# EAGLE design pmon_log (EAGLE 6.5.0)
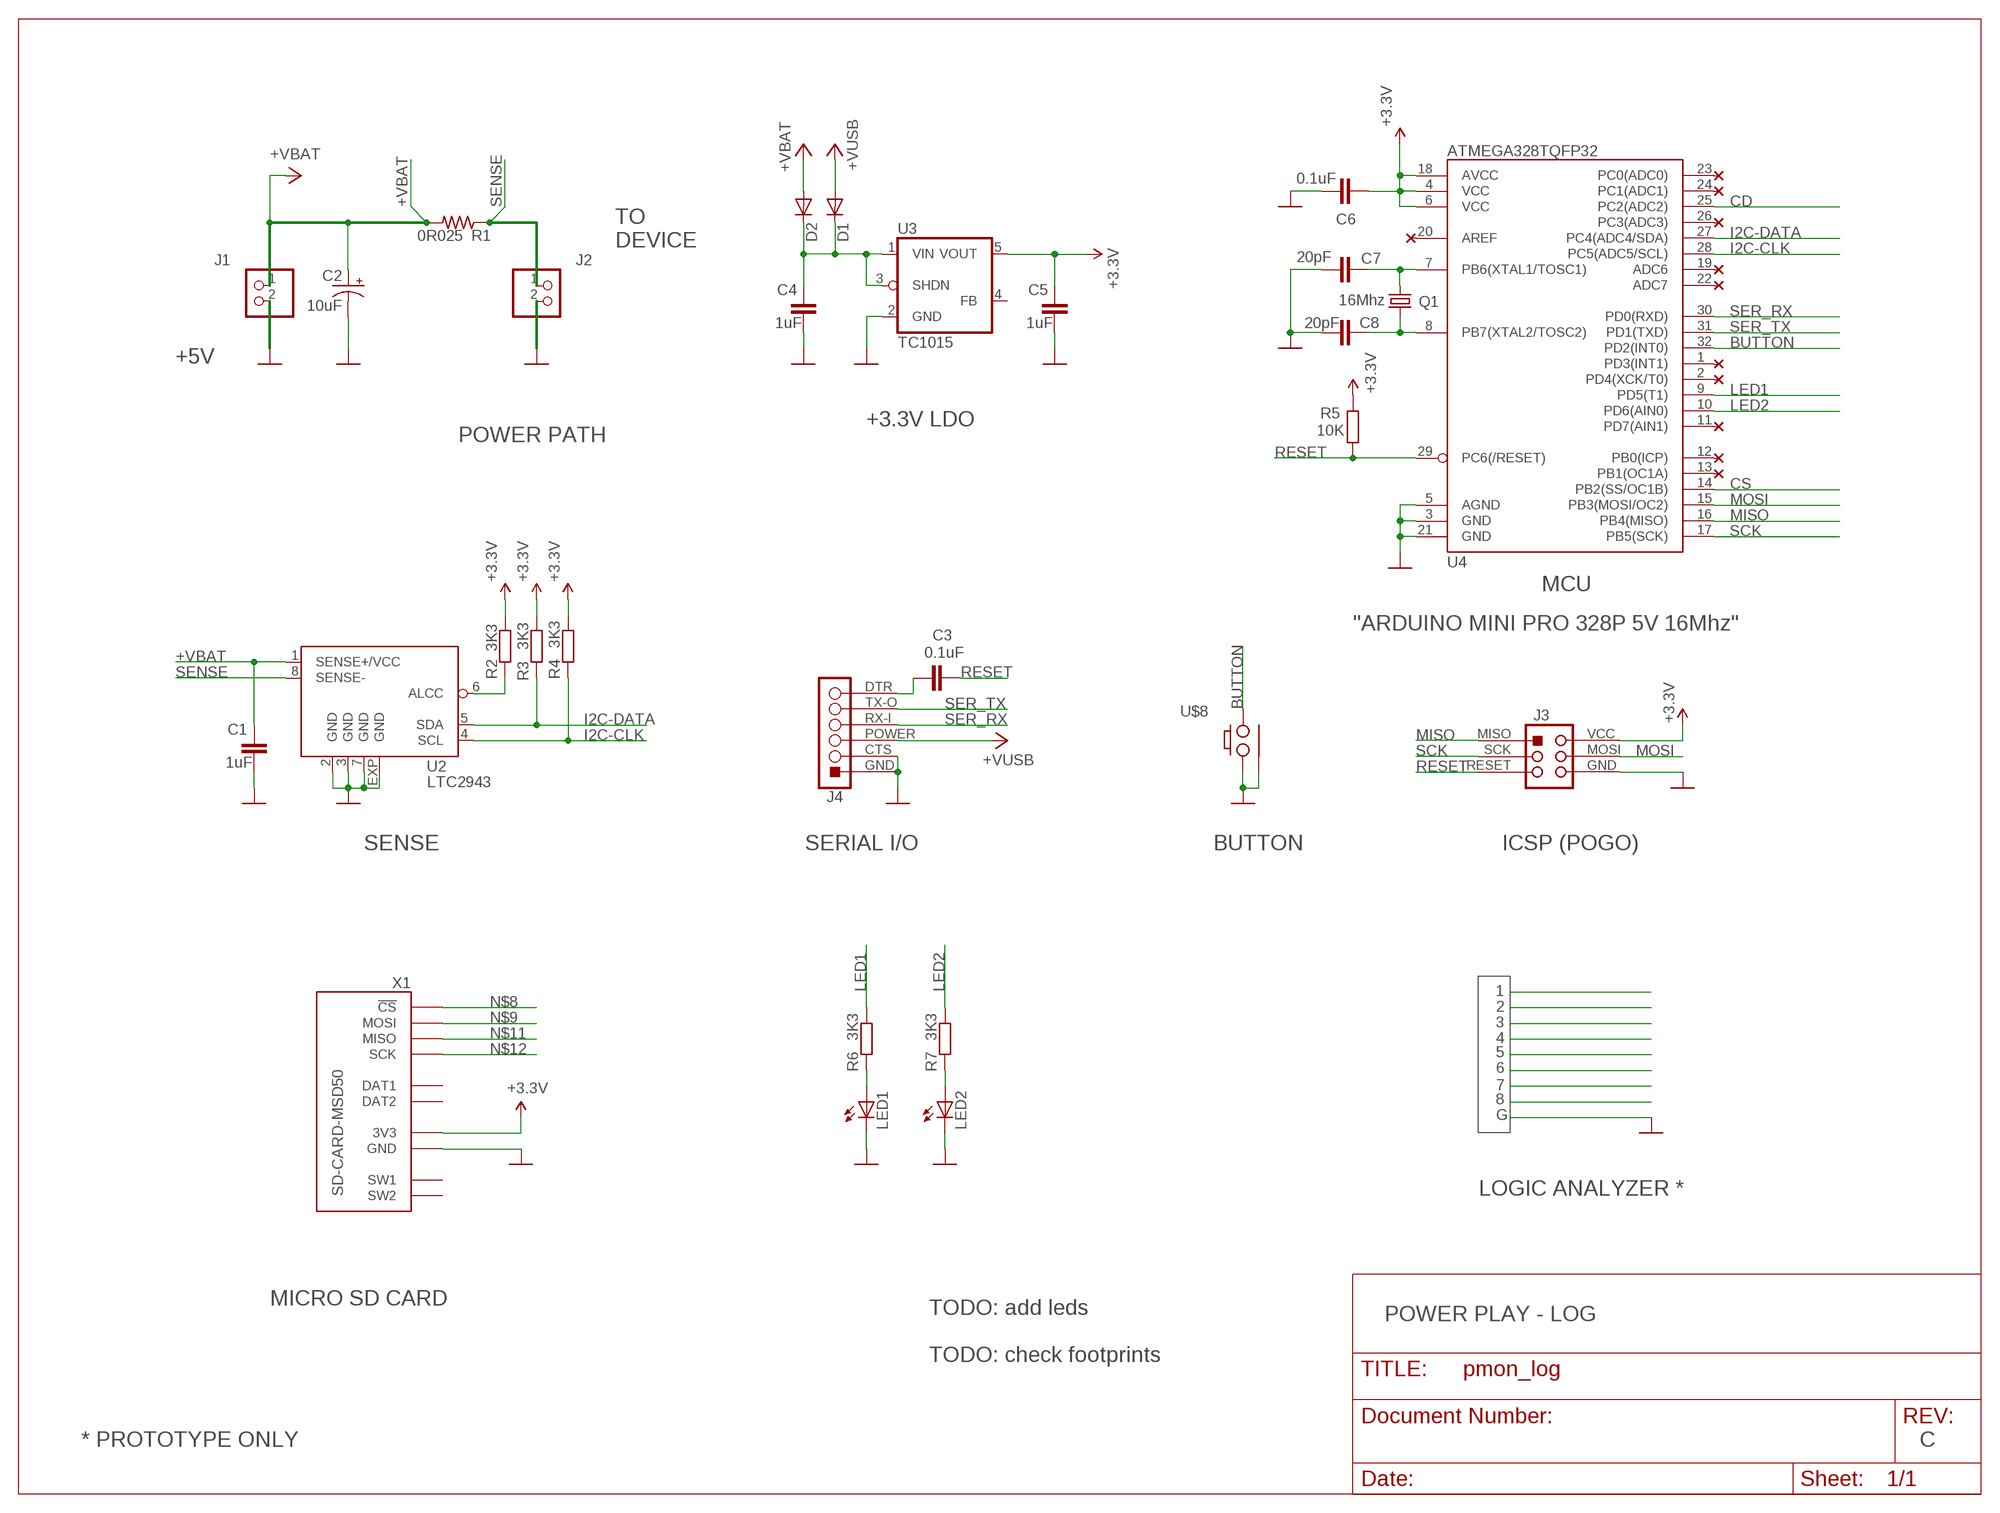
[diagram p0: schematic, sheet 1]

## Parts
C1  1uF  C-EUC0402K  [C0402K]
C2  10uF  CPOL-USA/3216-18R  [A/3216-18R]
C3  0.1uF  C-EUC0402K  [C0402K]
C4  1uF  C-EUC0402K  [C0402K]
C5  1uF  C-EUC0402K  [C0402K]
C6  0.1uF  C-EUC0402K  [C0402K]
C7  20pF  C-EUC0402K  [C0402K]
C8  20pF  C-EUC0402K  [C0402K]
D1  DIODE-SC79_INFINEON  [SC79_INFINEON]
D2  DIODE-SC79_INFINEON  [SC79_INFINEON]
J1  PINHD-1X2  [1X02]
J2  PINHD-1X2  [1X02]
J3  ICSP  [ICSP]
J4  SERIAL_HEADER  [SERIAL_HEADER]
LED1  LEDCHIPLED_0603  [CHIPLED_0603]
LED2  LEDCHIPLED_0603  [CHIPLED_0603]
Q1  16Mhz  CRYSTALCTS406  [CRYSTAL-CTS406]
R1  0R025  RES-R0603  [R0603]
R2  3K3  R-EU_R0402  [R0402]
R3  3K3  R-EU_R0402  [R0402]
R4  3K3  R-EU_R0402  [R0402]
R5  10K  R-EU_R0402  [R0402]
R6  3K3  R-EU_R0402  [R0402]
R7  3K3  R-EU_R0402  [R0402]
U2  LTC2943  [DFN8-3X3]
U3  TC1015  [SOT25]
U4  ATMEGA328TQFP32  [TQFP32-08]
U$8  PUSH_BUTTON_GND  [PUSH_BUTTON_GND]
X1  SD-CARD-MSD50  [SD_5031821853]

## Nets
+3.3V: X1.VCC(3V3)
+4V: C5.1 C6.1 J3.VCC R2.2 R3.2 R4.2 R5.2 U3.5(VOUT) U4.4(VCC) U4.6(VCC) U4.18(AVCC) ; supply symbol labelled +3.3V
+USB: D1.A J4.POWER ; supply symbol labelled +VUSB
+VBAT: C1.1 C2.+ D2.A J1.1 R1.2 U2.1(SENSE+/VCC)
BUTTON: U4.32(PD2(INT0)) U$8.HOLE1
CD: U4.25(PC2(ADC2))
CS: U4.14(PB2(SS/OC1B))
GND: C1.2 C2.- C4.2 C5.2 C6.2 C7.2 C8.2 J1.2 J2.2 J3.GND J4.CTS J4.GND LED1.C LED2.C U2.2(GND) U2.3(GND) U2.7(GND) U2.EXP(GND) U3.2(GND) U4.3(GND) U4.5(AGND) U4.21(GND) U$8.A1 U$8.GND X1.GND
I2C-CLK: R4.1 U2.4(SCL) U4.28(PC5(ADC5/SCL))
I2C-DATA: R3.1 U2.5(SDA) U4.27(PC4(ADC4/SDA))
LED1: R6.2 U4.9(PD5(T1))
LED2: R7.2 U4.10(PD6(AIN0))
MISO: J3.MISO U4.16(PB4(MISO))
MOSI: J3.MOSI U4.15(PB3(MOSI/OC2))
N$1: R2.1 U2.6(ALCC)
N$2: C7.1 Q1.1 U4.7(PB6(XTAL1/TOSC1))
N$4: C4.1 D1.C D2.C U3.1(VIN) U3.3(SHDN)
N$5: LED1.A R6.1
N$6: LED2.A R7.1
N$7: C8.1 Q1.3 U4.8(PB7(XTAL2/TOSC2))
N$8: X1.CS(!CS)
N$9: X1.MOSI
N$10: C3.2 J4.DTR
N$11: X1.MISO
N$12: X1.SCK
RESET: C3.1 J3.RESET R5.1 U4.29(PC6(/RESET))
SCK: J3.SCK U4.17(PB5(SCK))
SENSE: J2.1 R1.1 U2.8(SENSE-)
SER_RX: J4.RX-I U4.30(PD0(RXD))
SER_TX: J4.TX-O U4.31(PD1(TXD))
Unconnected: U3.4(FB) U4.1(PD3(INT1)) U4.2(PD4(XCK/T0)) U4.11(PD7(AIN1)) U4.12(PB0(ICP)) U4.13(PB1(OC1A)) U4.19(ADC6) U4.20(AREF) U4.22(ADC7) U4.23(PC0(ADC0)) U4.24(PC1(ADC1)) U4.26(PC3(ADC3)) X1.DAT1 X1.DAT2 X1.SW1 X1.SW2

## Notes on the sheet
- TO
  DEVICE
- +5V
- +3.3V LDO
- POWER PATH
- MCU
- "ARDUINO MINI PRO 328P 5V 16Mhz"
- SENSE | SERIAL I/O | BUTTON | ICSP (POGO)
- 1
- 2
- 3
- 4
- 5
- 6
- 7
- 8
- G
- LOGIC ANALYZER *
- MICRO SD CARD
- TODO: add leds | POWER PLAY - LOG
- TODO: check footprints
- * PROTOTYPE ONLY | C

## Library data of the parts
C1 C3-C8 = resistor:C-EU: CAPACITOR, European symbol
C2 = pmon_5v:CPOL-US
D1 D2 = diode:DIODE-: DIODE
J1 J2 = pmon_log:PINHD-1X2: PIN HEADER
J3 = pmon_log:ICSP
J4 = pmon_log:SERIAL_HEADER: PIN HEADER
LED1 LED2 = led:LED: LED OSRAM: - CHIPLED LG R971, LG N971, LY N971, LG Q971, LY Q971, LO R971, LY R971 LH N974, LH R974 LS Q976, LO Q976, LY Q976 LO Q996 - Hyper CHIPLED LW Q18S LB Q993, LB Q99A, LB R99A - SideLED LS A670, LO A670, LY A670, LG A670, LP A670 LB A673, LV A673, LT A673, LW A673 LH A674 LY A675 LS A676, LA A676, LO A676, LY A676, LW A676 LS A679, LY A679, LG A679 - Hyper Micro SIDELED® LS Y876, LA Y876, LO Y876, LY Y876 LT Y87S - SmartLED LW L88C, LW L88S LB L89C, LB L89S, LG L890 LS L89K, LO L89K, LY L89K LS L896, LA L896, LO L896, LY L896 - TOPLED LS T670, LO T670, LY T670, LG T670, LP T670 LSG T670, LSP T670, LSY T670, LOP T670, LYG T670 LG T671, LOG T671, LSG T671 LB T673, LV T673, LT T673, LW T673 LH T674 LS T676, LA T676, LO T676, LY T676, LB T676, LH T676, LSB T676, LW T676 LB T67C, LV T67C, LT T67C, LS T67K, LO T67K, LY T67K, LW E67C LS E67B, LA E67B, LO E67B, LY E67B, LB E67C, LV E67C, LT E67C LW T67C LS T679, LY T679, LG T679 LS T770, LO T770, LY T770, LG T770, LP T770 LB T773, LV T773, LT T773, LW T773 LH T774 LS E675, LA E675, LY E675, LS T675 LS T776, LA T776, LO T776, LY T776, LB T776 LHGB T686 LT T68C, LB T68C - Hyper Mini TOPLED® LB M676 - Mini TOPLED Santana® LG M470 LS M47K, LO M47K, LY M47K Source: http://www.osram.convergy.de LUXEON: - LUMILED® LXK2-PW12-R00, LXK2-PW12-S00, LXK2-PW14-U00, LXK2-PW14-V00 LXK2-PM12-R00, LXK2-PM12-S00, LXK2-PM14-U00 LXK2-PE12-Q00, LXK2-PE12-R00, LXK2-PE12-S00, LXK2-PE14-T00, LXK2-PE14-U00 LXK2-PB12-K00, LXK2-PB12-L00, LXK2-PB12-M00, LXK2-PB14-N00, LXK2-PB14-P00, LXK2-PB14-Q00 LXK2-PR12-L00, LXK2-PR12-M00, LXK2-PR14-Q00, LXK2-PR14-R00 LXK2-PD12-Q00, LXK2-PD12-R00, LXK2-PD12-S00 LXK2-PH12-R00, LXK2-PH12-S00 LXK2-PL12-P00, LXK2-PL12-Q00, LXK2-PL12-R00 Source: www.luxeon.com KINGBRIGHT: KA-3528ASYC Source: www.kingbright.com
Q1 = pmon_5v:CRYSTAL: CRYSTAL; OC_FARNELL: unknown; OC_NEWARK: unknown
R1 = pmon_5v:RES-: RESISTOR, American symbol
R2-R7 = resistor:R-EU_: RESISTOR, European symbol
U2 = pmon_5v:LTC2943
U3 = pmon_5v:TC1015: 150mA Low Noise LDO Voltage Regulator with Enable TSC [Taiwan Semiconductor Company, Ltd] Source: http://www.taiwansemi.com .. 5205_0409c.pdf
U4 = pmon_5v:ATMEGA328
U$8 = pmon_log:PUSH_BUTTON_GND
X1 = pmon_log:SD-CARD; DIGIKEY: WM9750TR-ND

## Net classes
1 power: width 0.254 mm

## Board
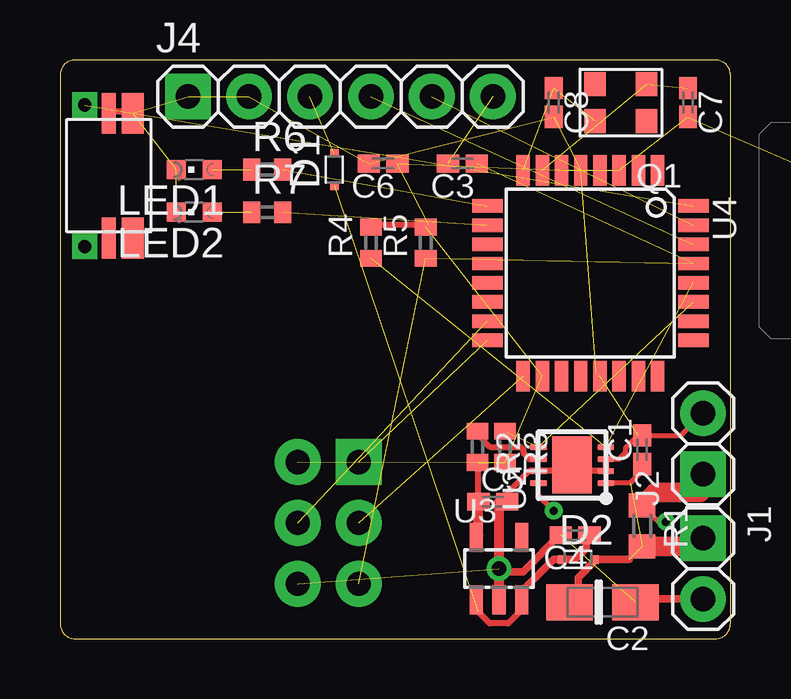
[diagram p1: board, top side]
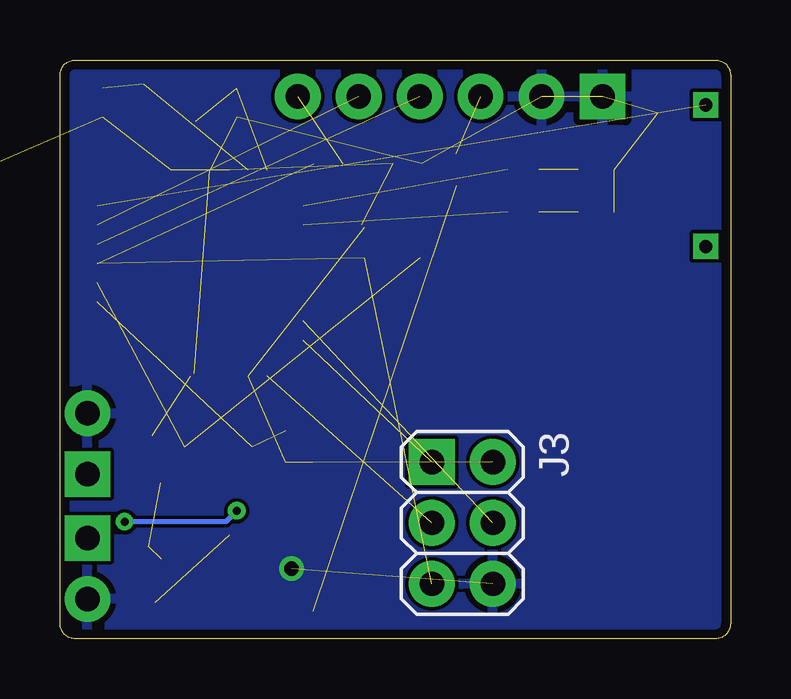
[diagram p2: board, bottom side, seen from below]

Size 27.94 x 24.13 mm. Coordinates in mm from the lower left corner, seen from the top.
Outline: 0.64,0 27.3,0 arc90 27.94,0.64 27.94,23.5 arc90 27.3,24.13 0.64,24.13 arc90 0,23.5 0,0.64 arc90 0.64,0
Copper layers (1*16): Top 0.035mm / dielectric 1.5mm / Bottom 0.035mm
Design rules "default *": minimum track width 10mil, minimum drill 24mil, track to track 6mil, track to pad 6mil, pad to pad 6mil, via to via 6mil, smd to smd 0mil, copper to edge 15mil, drill to drill 8mil, minimum pad ring 10mil, minimum via ring 8mil, stop-mask expansion 4mil, vias tented up to drill 0mil, thermal gap 10mil

### Footprints (pad centres in the part's own frame; a part is rotated, then mirrored left to right if it is on the bottom)
C0402K = smd 0.925 x 0.74: 1 -0.6,0; 2 0.6,0
A/3216-18R = smd 1.95 x 1.5: + 1.375,0; - -1.375,0
SC79_INFINEON = smd 0.35 x 0.35: A 0.675,0; C -0.675,0
1X02 = drill 1.016 pad 1.905 square: 1 -1.27,0 | drill 1.016 pad 1.905: 2 1.27,0
ICSP = drill 1.016 pad 1.905: GND 2.54,1.27; MOSI 0,1.27; RESET 2.54,-1.27; SCK 0,-1.27; VCC -2.54,1.27 | drill 1.016 pad 1.905 square: MISO -2.54,-1.27
SERIAL_HEADER = drill 1.016 pad 1.905: CTS -3.81,0; DTR 6.35,0; POWER -1.27,0; RX-I 1.27,0; TX-O 3.81,0 | drill 1.016 pad 1.905 square: GND -6.35,0
CHIPLED_0603 = smd 0.8 x 0.8: A 0,-0.75; C 0,0.75
CRYSTAL-CTS406 = smd 0.9 x 1: 1 -1.075,-0.775; 2 1.075,-0.775; 3 1.075,0.775; 4 -1.075,0.775
R0603 = smd 1 x 1.1: 1 -0.85,0; 2 0.85,0
R0402 = smd 0.7 x 0.9: 1 -0.65,0; 2 0.65,0
DFN8-3X3 = smd 0.25 x 0.7: 1 -0.75,-1.4; 2 -0.25,-1.4; 3 0.25,-1.4; 4 0.75,-1.4; 5 0.75,1.4; 6 0.25,1.4; 7 -0.25,1.4; 8 -0.75,1.4 | smd 2.38 x 1.65: EXP 0,0
SOT25 = smd 0.55 x 1.2: 1 -0.95,-1.3; 2 0,-1.3; 3 0.95,-1.3; 4 0.95,1.3; 5 -0.95,1.3
TQFP32-08 = smd 1.27 x 0.559: 1 -4.293,2.8; 2 -4.293,2; 3 -4.293,1.2; 4 -4.293,0.4; 5 -4.293,-0.4; 6 -4.293,-1.2; 7 -4.293,-2; 8 -4.293,-2.8; 17 4.293,-2.8; 18 4.293,-2; 19 4.293,-1.2; 20 4.293,-0.4; 21 4.293,0.4; 22 4.293,1.2; 23 4.293,2; 24 4.293,2.8 | smd 0.559 x 1.27: 9 -2.8,-4.293; 10 -2,-4.293; 11 -1.2,-4.293; 12 -0.4,-4.293; 13 0.4,-4.293; 14 1.2,-4.293; 15 2,-4.293; 16 2.8,-4.293; 25 2.8,4.293; 26 2,4.293; 27 1.2,4.293; 28 0.4,4.293; 29 -0.4,4.293; 30 -1.2,4.293; 31 -2,4.293; 32 -2.8,4.293
PUSH_BUTTON_GND = smd 1.7 x 0.9: A1 -2.6,1; A2 2.6,1 | smd 1.7 x 0.6: B 2.6,0; GND -2.6,0 | drill 0.55 pad 0.9 square: HOLE1 -2.95,-1; HOLE2 2.95,-1
SD_5031821853 = smd 0.65 x 1.6: CS 2.75,0.8; DAT1 -3.85,0.8; DAT2 3.85,0.8; GND -1.65,0.8; MISO -2.75,0.8; MOSI 1.65,0.8; SCK -0.55,0.8; VCC 0.55,0.8 | smd 1 x 1.2: SW1 -6,12.45; SW2 -6,3.3

### Placement (x,y rotation side)
C1  24.26,7.87 90 top
C2  22.61,1.52 180 top
C3  16.76,19.81 180 top
C4  21.46,4.32 180 top
C5  18.03,5.71 0 top
C6  13.46,19.81 180 top
C7  26.16,22.35 270 top
C8  20.57,22.35 270 top
D1  11.43,19.56 90 top
D2  21.59,3.3 0 top
J1  26.8,2.92 270 top
J2  26.8,8.13 90 top
J3  11.18,4.83 270 bottom
J4  11.68,22.61 0 top
LED1  5.59,19.56 90 top
LED2  5.59,17.78 90 top
Q1  23.37,22.35 180 top
R1  24.26,4.7 270 top
R2  17.4,8 270 top
R3  18.54,8 270 top
R4  12.95,16.51 90 top
R5  15.24,16.51 90 top
R6  8.64,19.56 0 top
R7  8.64,17.78 0 top
U2  21.34,7.24 90 top
U3  18.29,2.92 0 top
U4  22.1,15.24 270 top
U$8  2.03,19.3 270 top
X1  32.51,17.02 270 top  (outside the outline)

### Tracks (layer width: path | path; a pad name or v marks a point on that pad's centre or on a via)
+4V  (7 unrouted)
  Top 0.254: R5.2 15.37,17.27 13.08,17.27 R4.2 | 17.53,5.71 C5.1 17.4,5.71 R2.2 | 17.27,4.32 U3.5
  Top 0.406: 17.27,4.32 17.43,4.32 C5.1
+USB  (1 unrouted)
+VBAT  (2 unrouted)
  Top 0.203: C1.1 24.26,6.99 23.76,6.49 U2.1
  Top 0.305: 21.34,1.63 C2.+ 21.59,1.88 21.59,2.54 22.27,3.21 D2.A 23.71,3.3
  Top 0.813: J1.1 26.45,3.85 R1.2
BUTTON  (1 unrouted)
GND  (via drill 0.61)  (14 unrouted)
  Top 0.203: U2.3 23.29,7.49 23.57,7.77 23.57,7.95 24.09,8.47 C1.2 25.87,8.47 J2.2
  Top 0.254: U$8.GND 2.03,21.97 2.92,21.97 U$8.A1 | 18.54,5.71 C5.2 18.67,5.71 18.67,6.1 19.56,6.99 19.81,6.99 U2.7 21.34,6.99 | 21.34,6.99 U2.2 22.73,7.11 22.73,7.37 U2.3 | 22.35,11.05 U4.21 | 21.34,6.99 U2.EXP
  Top 0.305: J1.2 24.11,1.65 C2.- | C4.2 20.83,4.32 19.3,2.79 18.41,2.79 v18.29,2.92
  Top 0.406: 18.54,5.71 18.29,5.71 v18.29,2.92 U3.2
  pour Bottom: 0,0 28.19,0 27.94,24.13 0,24.13
I2C-CLK  (2 unrouted)
I2C-DATA  (2 unrouted)
LED1  (1 unrouted)
LED2  (1 unrouted)
MISO  (1 unrouted)
MOSI  (1 unrouted)
N$1
  Top 0.254: R2.1 17.4,8.51 17.91,8 19.18,8 19.3,7.87 19.3,7.75 19.56,7.49 19.81,7.49 U2.6
N$2  (2 unrouted)
N$4  (1 unrouted)
  Top 0.254: U3.1 17.4,1.52 17.4,1.14 17.91,0.64 18.67,0.64 19.18,1.14 19.18,1.52 U3.3
  Top 0.305: C4.1 21.92,4.17 21.92,3.76 21.46,3.3 D2.C 20.57,3.3 19.3,2.03 19.3,1.69 U3.3
N$5  (1 unrouted)
N$6  (1 unrouted)
N$7  (2 unrouted)
N$10  (1 unrouted)
RESET  (3 unrouted)
SCK  (1 unrouted)
SENSE  (via drill 0.33)
  Top 0.203: R1.1 24.93,4.88 v25.25,4.88 | v20.57,5.33 19.94,5.97 U2.8
  Top 0.813: R1.1 24.8,6.1 26.67,6.1 26.8,6.22 J2.1
  Bottom 0.203: v20.57,5.33 21.03,4.88 v25.25,4.88
SER_RX  (1 unrouted)
SER_TX  (1 unrouted)